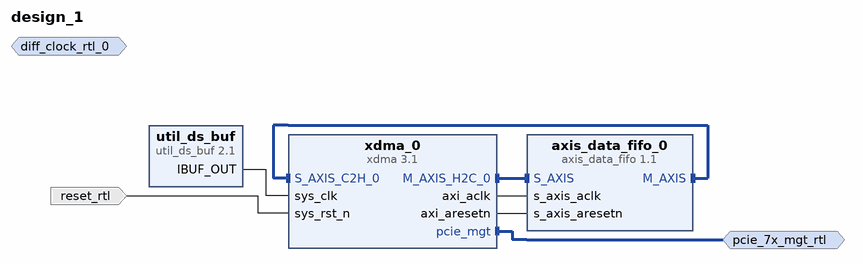
[diagram p0: block diagram of the top level]
# Vivado block design design_1, xc7k325tffg900-2, Vivado 2017.1
create_bd_design design_1

create_bd_intf_port -mode Master -vlnv xilinx.com:interface:pcie_7x_mgt_rtl:1.0 pcie_7x_mgt_rtl
create_bd_intf_port -mode Slave -vlnv xilinx.com:interface:diff_clock_rtl:1.0 diff_clock_rtl_0
set_property -dict {CONFIG.FREQ_HZ 100000000} [get_bd_intf_ports diff_clock_rtl_0]
create_bd_port -dir I -type rst reset_rtl
set_property -dict {CONFIG.POLARITY ACTIVE_LOW} [get_bd_ports reset_rtl]

create_bd_cell -type ip -vlnv xilinx.com:ip:xdma:3.1 xdma_0
set_property -dict [list \
  CONFIG.pl_link_cap_max_link_width X4 \
  CONFIG.pl_link_cap_max_link_speed 5.0_GT/s \
  CONFIG.ref_clk_freq 100_MHz \
  CONFIG.axi_data_width 64_bit \
  CONFIG.axisten_freq 250 \
  CONFIG.pf0_device_id 7024 \
  CONFIG.axilite_master_en false \
  CONFIG.xdma_rnum_chnl 1 \
  CONFIG.xdma_wnum_chnl 1 \
  CONFIG.plltype QPLL1 \
  CONFIG.xdma_axi_intf_mm AXI_Stream \
  CONFIG.cfg_mgmt_if false \
] [get_bd_cells xdma_0]
create_bd_cell -type ip -vlnv xilinx.com:ip:axis_data_fifo:1.1 axis_data_fifo_0
create_bd_cell -type ip -vlnv xilinx.com:ip:util_ds_buf:2.1 util_ds_buf
set_property -dict {CONFIG.C_BUF_TYPE IBUFDSGTE} [get_bd_cells util_ds_buf]

# ---- connections ----

connect_bd_intf_net [get_bd_intf_pins xdma_0/S_AXIS_C2H_0] [get_bd_intf_pins axis_data_fifo_0/M_AXIS]
connect_bd_intf_net [get_bd_intf_pins axis_data_fifo_0/S_AXIS] [get_bd_intf_pins xdma_0/M_AXIS_H2C_0]
connect_bd_intf_net [get_bd_intf_ports pcie_7x_mgt_rtl] [get_bd_intf_pins xdma_0/pcie_mgt]
connect_bd_net [get_bd_ports reset_rtl] [get_bd_pins xdma_0/sys_rst_n]
connect_bd_net [get_bd_pins xdma_0/axi_aclk] [get_bd_pins axis_data_fifo_0/s_axis_aclk]
connect_bd_net [get_bd_pins xdma_0/axi_aresetn] [get_bd_pins axis_data_fifo_0/s_axis_aresetn]
connect_bd_net [get_bd_pins util_ds_buf/IBUF_OUT] [get_bd_pins xdma_0/sys_clk]

validate_bd_design
save_bd_design
